# Altium schematic sheet protecter.SchDoc
size A4
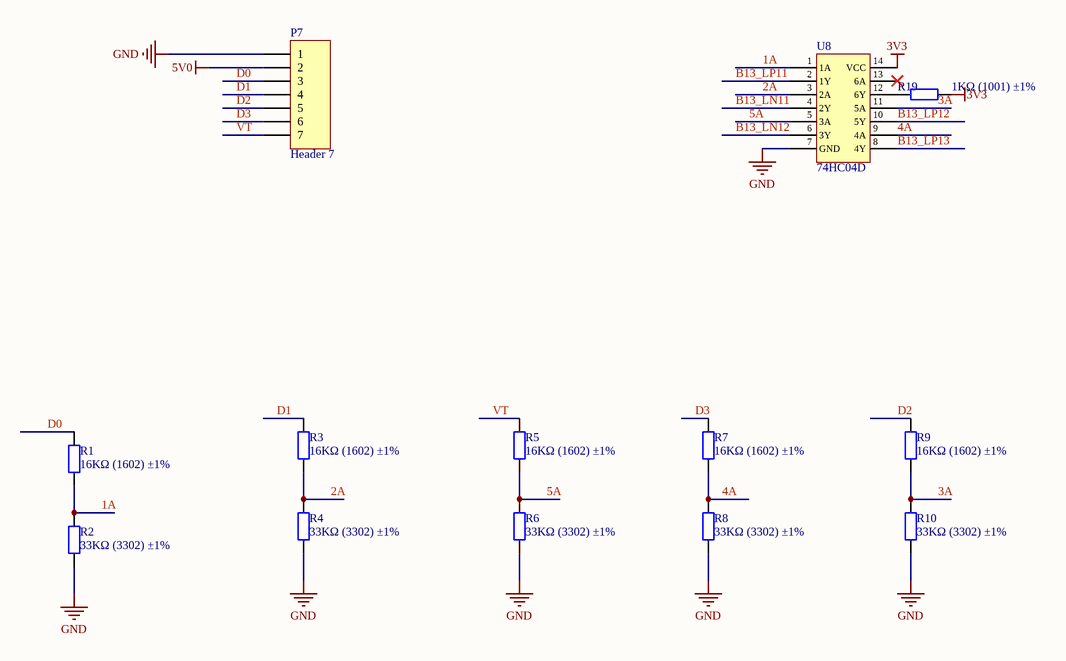
[diagram p0: protecter.SchDoc]

## Parts
P7  Header 7  [HDR1X7]
R1  16KΩ (1602) ±1%  [0603_R]
R2  33KΩ (3302) ±1%  [0402_R]
R3  16KΩ (1602) ±1%  [0603_R]
R4  33KΩ (3302) ±1%  [0402_R]
R5  16KΩ (1602) ±1%  [0603_R]
R6  33KΩ (3302) ±1%  [0402_R]
R7  16KΩ (1602) ±1%  [0603_R]
R8  33KΩ (3302) ±1%  [0402_R]
R9  16KΩ (1602) ±1%  [0603_R]
R10  33KΩ (3302) ±1%  [0402_R]
R19  1KΩ (1001) ±1%  [0402_R]
U8  74HC04D  [SOIC-14_150mil]

## Nets
3V3: R19.2 U8.14(VCC)
5V0: P7.2
GND: P7.1 R2.1 R4.1 R6.1 R8.1 R10.1 U8.7(GND)
1A: R1.1 R2.2 U8.1(1A)
2A: R3.1 R4.2 U8.3(2A)
3A: R9.1 R10.2 U8.11(5A)
4A: R7.1 R8.2 U8.9(4A)
5A: R5.1 R6.2 U8.5(3A)
B13_LN11: U8.4(2Y)
B13_LN12: U8.6(3Y)
B13_LP11: U8.2(1Y)
B13_LP12: U8.10(5Y)
B13_LP13: U8.8(4Y)
D0: P7.3 R1.2
D1: P7.4 R3.2
D2: P7.5 R9.2
D3: P7.6 R7.2
VT: P7.7 R5.2
NetR19_1: R19.1 U8.12(6Y)

Not connected (* = marked no-connect by the designer): U8 13(6A)*

## Library data of the parts
P7 = Header 7: Header, 7-Pin; LatestRevisionDate: 17-Jul-2002; LatestRevisionNote: Re-released for DXP Platform.; Publisher: Altium Limited
R1 R3 R5 R7 R9 = 0603 16KΩ (1602) 1%: 贴片电阻; ComponentLink1Description: 供应商链接; ComponentLink1URL: http://www.szlcsc.com/product/details_23545.html; Package: 0603; Supplier: LC; SuppliersPartNumber: C22818
R2 R4 R6 R8 R10 = 0402 33KΩ (3302) 1%: 贴片电阻; ComponentLink1Description: 供应商链接; ComponentLink1URL: http://www.szlcsc.com/product/details_26522.html; Package: 0402; Supplier: LC; SuppliersPartNumber: C25779
R19 = 0402 1KΩ (1001) 1%: 贴片电阻; ComponentLink1Description: 供应商链接; ComponentLink1URL: http://www.szlcsc.com/product/details_12256.html; Package: 0402; Supplier: LC; SuppliersPartNumber: C11702